# EasyEDA schematic 1-Schematic_LaserGame_plastron_v1.json
TITLE: Sheet_1; REV: 1.0; Date: 2020-12-11; Sheet: 1/1; Drawn By: Josselin Somerville Roberts; Company: Your Company
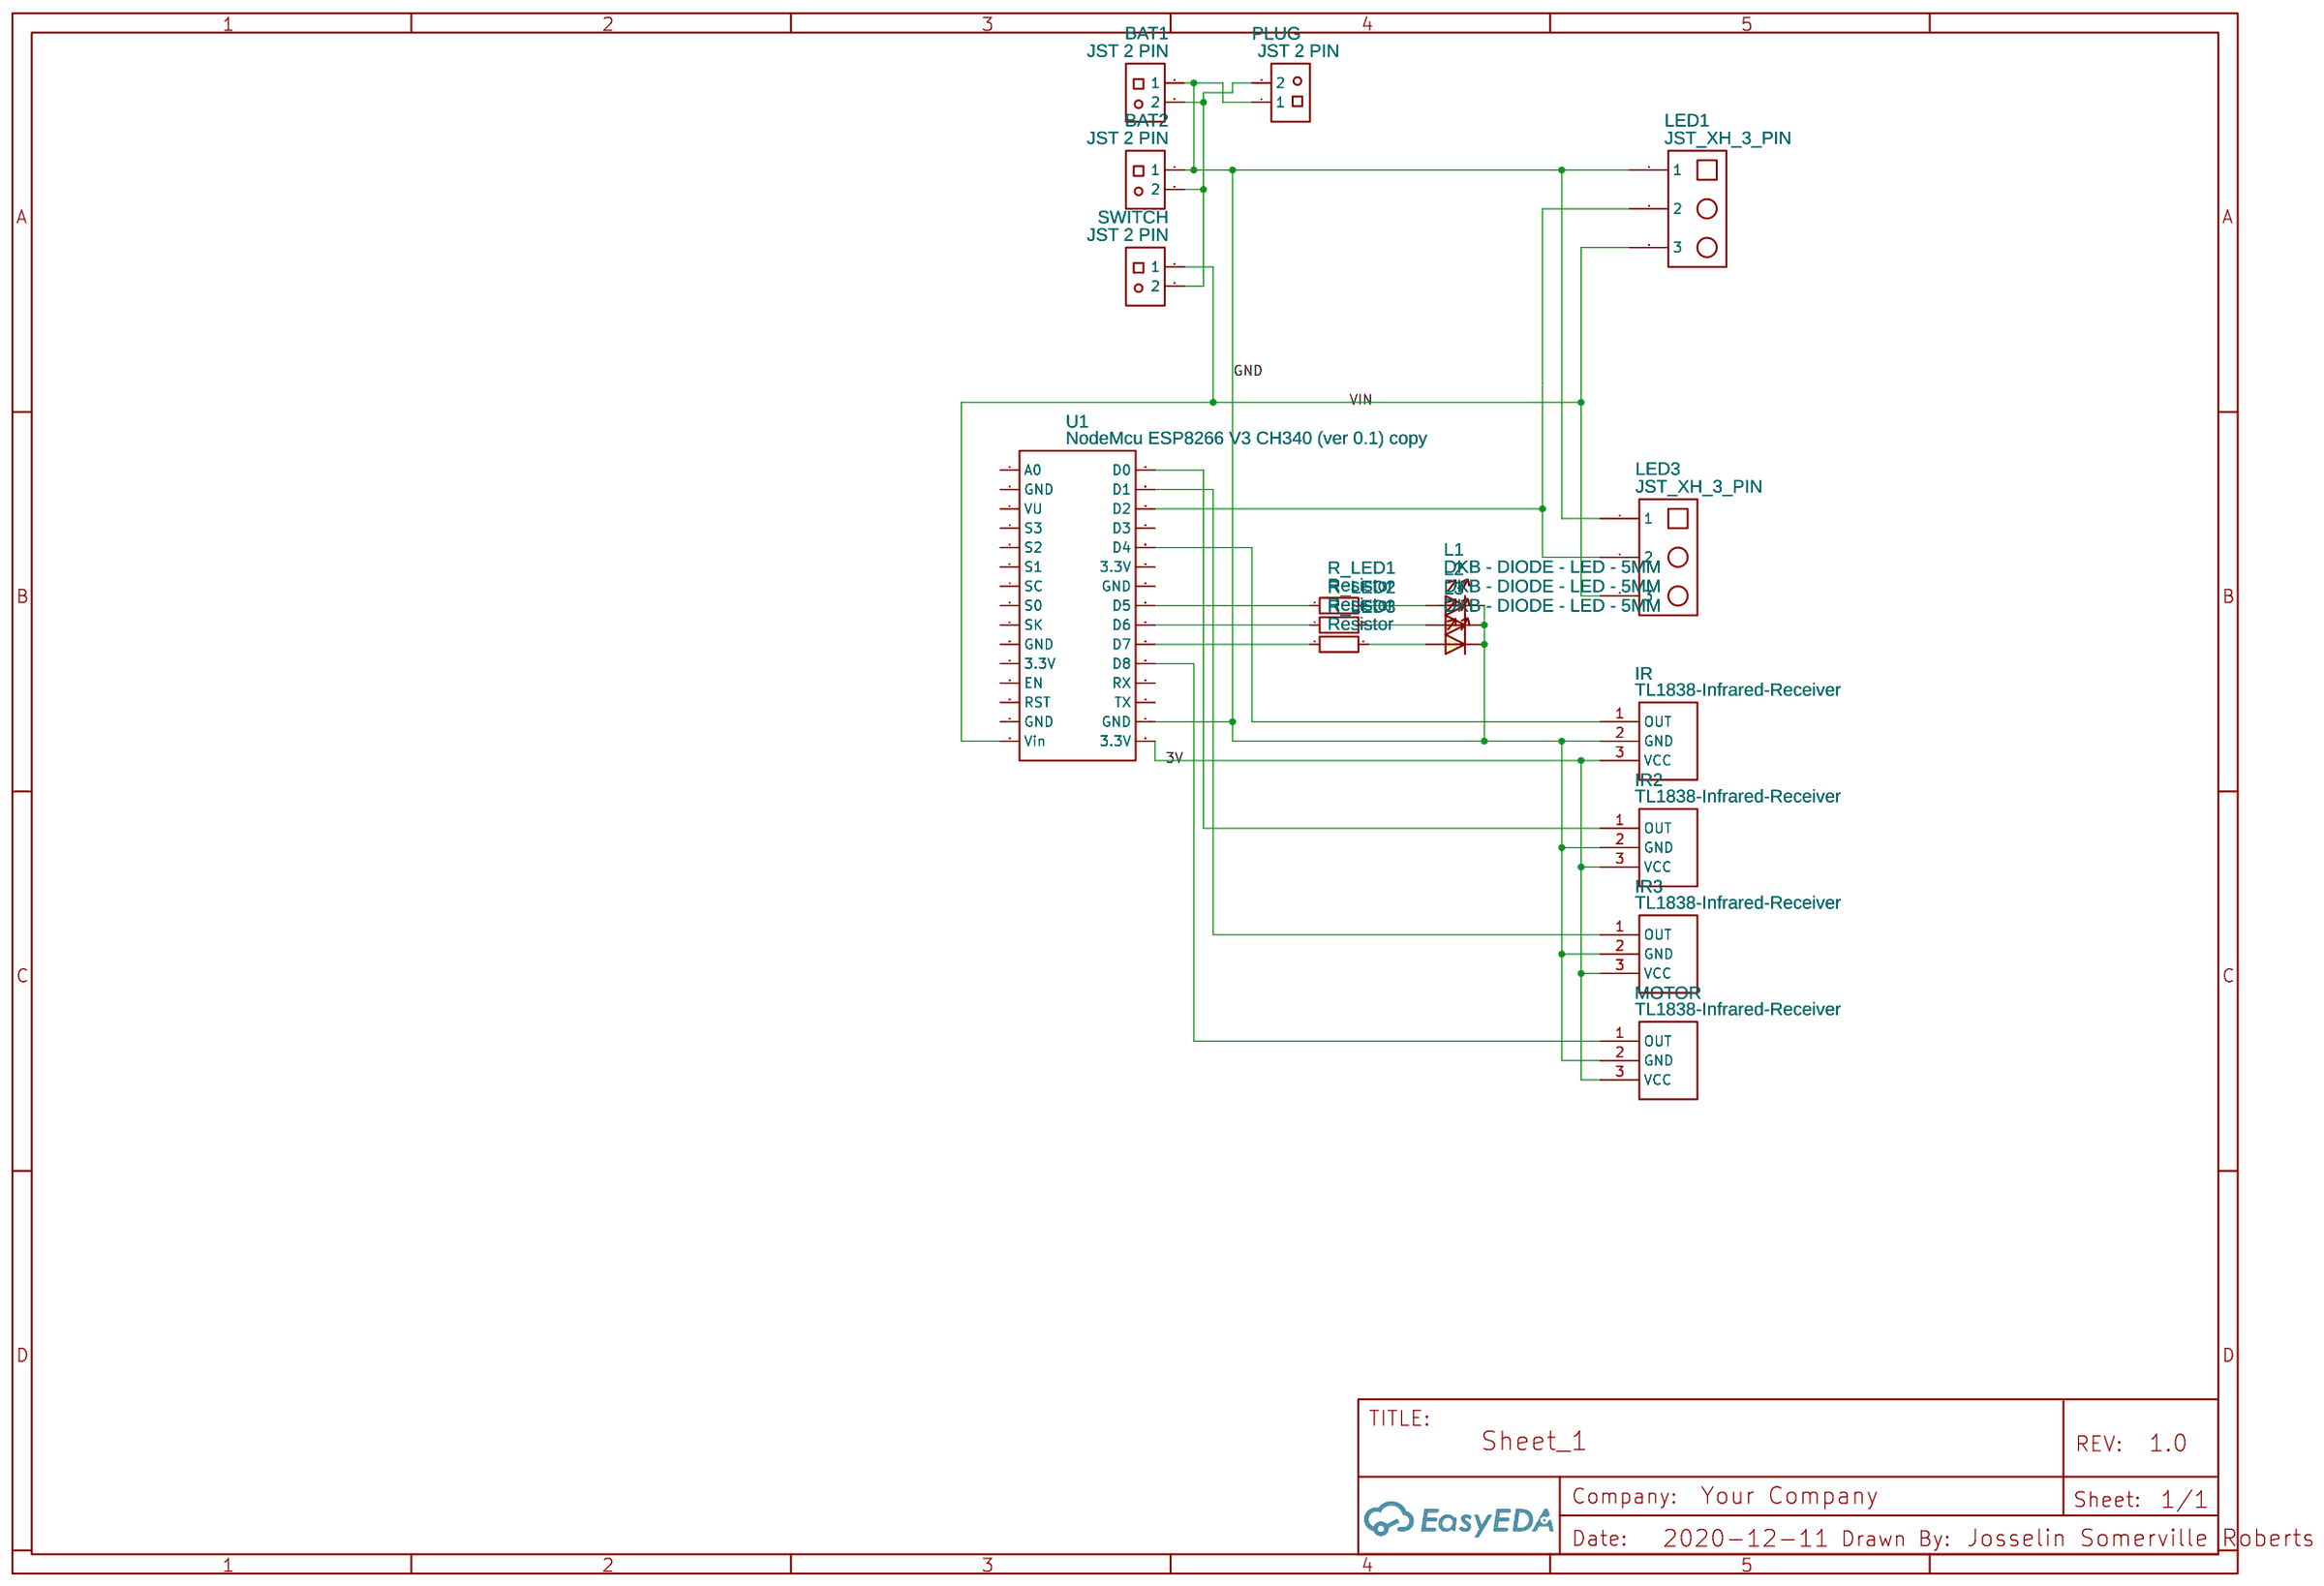
[diagram p0: schematic sheet]

## Parts
BAT1  JST 2 PIN  [JST_2-PIN_2.54MM]
BAT2  JST 2 PIN  [JST_2-PIN_2.54MM]
IR  TL1838-Infrared-Receiver  [TL1838-INFRARED-RECEIVER]
IR2  TL1838-Infrared-Receiver  [TL1838-INFRARED-RECEIVER]
IR3  TL1838-Infrared-Receiver  [TL1838-INFRARED-RECEIVER]
L1  DKB - DIODE - LED - 5MM  [5MM LED]
L2  DKB - DIODE - LED - 5MM  [5MM LED]
L3  DKB - DIODE - LED - 5MM  [5MM LED]
LED1  JST_XH_3_PIN  [JST_XH_03X2.50MM]
LED3  JST_XH_3_PIN  [JST_XH_03X2.50MM]
MOTOR  TL1838-Infrared-Receiver  [TL1838-INFRARED-RECEIVER]
PLUG  JST 2 PIN  [JST_2-PIN_2.54MM]
R_LED1  Resistor  [RESISTOR]
R_LED2  Resistor  [RESISTOR]
R_LED3  Resistor  [RESISTOR]
SWITCH  JST 2 PIN  [JST_2-PIN_2.54MM]
U1  NodeMcu ESP8266 V3 CH340 (ver 0.1) copy  [NEW PCB NODEMCUV3]

## Library data of the parts
BAT1 BAT2 PLUG SWITCH = JST 2 PIN: Manufacturer Part: JST_XH CONNECTOR; link: https://nl.aliexpress.com/item/50-sets-Kit-in-doos-2-p-3-p-4-pin-2-54mm-Pitch-Terminal-Behuizing/32681086028.html?spm=a2g0s.9042311.0.0.I0g15Z; Contributor: CowboyWillT
IR IR2 IR3 MOTOR = TL1838-Infrared-Receiver: Manufacturer: OpenImpulse; Manufacturer Part: TL1838; link: http://eeshop.unl.edu/pdf/VS1838-Infrared-Receiver-datasheet.pdf; Contributor: Anthony Stuart
L1-L3 = DKB - DIODE - LED - 5MM: Manufacturer Part: 5mm LED; Contributor: Axbri
LED1 LED3 = JST_XH_3_PIN: Manufacturer Part: JST AMERICAN SALES; Contributor: lantonyj; LCSC: C161870
R_LED1-R_LED3 = Resistor: Contributor: ChaseWyattt
U1 = NodeMcu ESP8266 V3 CH340 (ver 0.1) copy: Manufacturer Part: CH340 NodeMcu V3; Contributor: Gecsogen Qwerty

## Nets
3V: IR.3(VCC) IR2.3(VCC) IR3.3(VCC) MOTOR.3(VCC) U1.16(3.3V)
GND: BAT1.1 BAT2.1 IR.2(GND) IR2.2(GND) IR3.2(GND) L1.2 L2.2 L3.2 LED1.1 LED3.1 MOTOR.2(GND) PLUG.1 U1.17(GND)
VIN: LED1.3 LED3.3 SWITCH.1 U1.15(Vin)
Net-(BAT1-2): BAT1.2 BAT2.2 PLUG.2 SWITCH.2
Net-(IR2-1): IR2.1(OUT) U1.30(D0)
Net-(IR3-1): IR3.1(OUT) U1.29(D1)
Net-(IR-1): IR.1(OUT) U1.26(D4)
Net-(L1-1): L1.1 R_LED1.1
Net-(L2-1): L2.1 R_LED2.1
Net-(L3-1): L3.1 R_LED3.1
Net-(LED1-2): LED1.2 LED3.2 U1.28(D2)
Net-(MOTOR-1): MOTOR.1(OUT) U1.20(D8)
Net-(R_LED1-2): R_LED1.2 U1.23(D5)
Net-(R_LED2-2): R_LED2.2 U1.22(D6)
Net-(R_LED3-2): R_LED3.2 U1.21(D7)

Not connected (* = marked no-connect by the designer): U1 1(A0) 2(GND) 3(VU) 4(S3) 5(S2) 6(S1) 7(SC) 8(S0) 9(SK) 10(GND) 11(3.3V) 12(EN) 13(RST) 14(GND) 18(TX) 19(RX) 24(GND) 25(3.3V) 27(D3)
